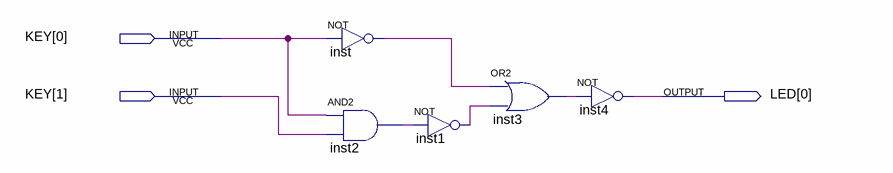
[diagram p0: schematic sheet]
// Quartus schematic EDWARD3.bdf as structural Verilog: 5 symbols, 3 pins
module EDWARD3 (
  input  [1:0] KEY,
  output [0:0] LED
);

  wire inst1_out, inst2_out, inst3_out, inst_out;

  not inst (inst_out, KEY[0]);
  and inst2 (inst2_out, KEY[0], KEY[1]);
  not inst1 (inst1_out, inst2_out);
  or inst3 (inst3_out, inst_out, inst1_out);
  not inst4 (LED[0], inst3_out);
endmodule
